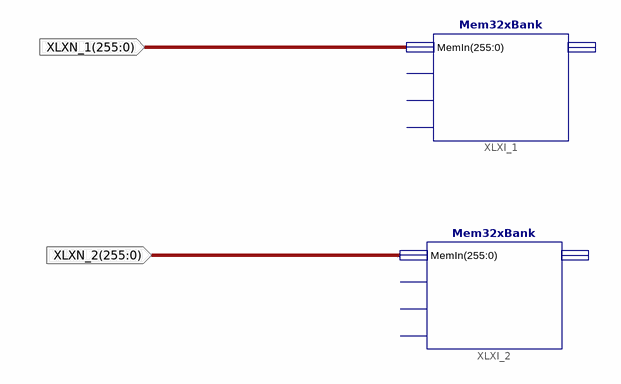
[diagram p0: schematic sheet 1]
// Xilinx ISE schematic MainMemory.sch (spartan3e) as structural Verilog: 2 symbols, 2 ports
module MainMemory (
  input  [255:0] XLXN_1,
  input  [255:0] XLXN_2
);

  Mem32xBank XLXI_1 (.MemIn(XLXN_1));  // open: CE, CLK, CLR, MemOut
  Mem32xBank XLXI_2 (.MemIn(XLXN_2));  // open: CE, CLK, CLR, MemOut
endmodule
